# Altium project TAUV-Thruster_Board.PrjPcb
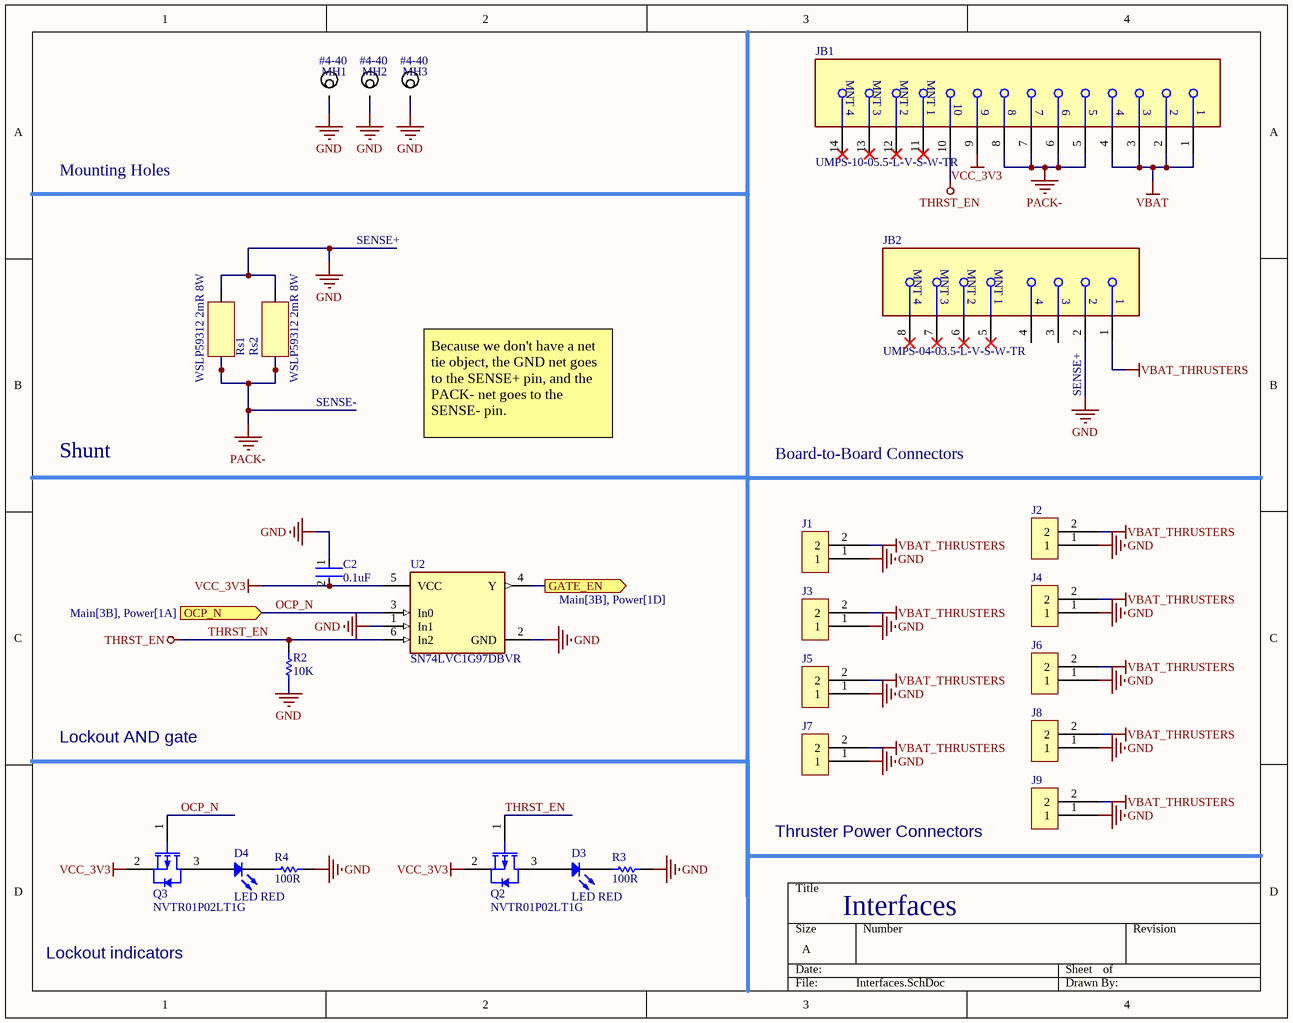
[diagram p0: Interfaces.SchDoc]
2 sheets, 41 parts. Net scope: flat (ports and power ports of the same name join across sheets).
Board file: TAUV-Thruster_Board.PcbDoc
Sheets:
  Interfaces.SchDoc
  Power.SchDoc

## Sheet Interfaces.SchDoc
size A; SheetNumber: 2; SheetTotal: 3

### Parts
C2  0.1uF  [FP-C0603C-CF-MFG]
D3  LED RED  [C0805]
D4  LED RED  [C0805]
J1  (no value)  [2-pin Megafit RA]
J2  (no value)  [2-pin Megafit RA]
J3  (no value)  [2-pin Megafit RA]
J4  (no value)  [2-pin Megafit RA]
J5  (no value)  [2-pin Megafit RA]
J6  (no value)  [2-pin Megafit RA]
J7  (no value)  [2-pin Megafit RA]
J8  (no value)  [2-pin Megafit RA]
J9  (no value)  [2-pin Megafit RA]
JB1  UMPS-10-05.5-L-V-S-W-TR  [FP-UMPS-10-05_5-L-V-S-W-T-MFG]
JB2  UMPS-04-03.5-L-V-S-W-TR  [FP-UMPS-04-03_5-L-V-S-W-T-MFG]
MH1  #4-40  [Mounting Hole #4-40]
MH2  #4-40  [Mounting Hole #4-40]
MH3  #4-40  [Mounting Hole #4-40]
Q2  NVTR01P02LT1G  [ONSC-SOT-23-3-318-08_V]
Q3  NVTR01P02LT1G  [ONSC-SOT-23-3-318-08_V]
R2  10K  [RESC0603(1608)_N]
R3  100R  [RESC1609X50X30NL10T20]
R4  100R  [RESC1609X50X30NL10T20]
Rs1  WSLP59312 2mR 8W  [WSLP59312L000FEA]
Rs2  WSLP59312 2mR 8W  [WSLP59312L000FEA]
U2  SN74LVC1G97DBVR  [FP-DBV0006A-MFG]

### Ports
GATE_EN (out, see Main[3B], Power[1D]), OCP_N (in, see Main[3B], Power[1A])

### Nets
GND: C2.1 J1.1 J2.1 J3.1 J4.1 J5.1 J6.1 J7.1 J8.1 J9.1 JB2.2 MH1.0 MH2.0 MH3.0 R2.2 R3.2 R4.2 Rs1.2 Rs2.2 U2.1(In1) U2.2(GND)
PACK-: JB1.5 JB1.6 JB1.7 JB1.8 Rs1.1 Rs2.1
THRST_EN: JB1.10 Q2.1(G) R2.1 U2.6(In2)
VBAT: JB1.1 JB1.2 JB1.3 JB1.4
VBAT_THRUSTERS: J1.2 J2.2 J3.2 J4.2 J5.2 J6.2 J7.2 J8.2 J9.2 JB2.1
VCC_3V3: C2.2 JB1.9 Q2.2(S) Q3.2(S) U2.5(VCC)
OCP_N: Q3.1(G) U2.3(In0) ; port OCP_N
NetD3_1: D3.1(K) R3.1
NetD3_2: D3.2(A) Q2.3(D)
NetD4_1: D4.1(K) R4.1
NetD4_2: D4.2(A) Q3.3(D)
NetRin1_2: U2.4(Y) ; port GATE_EN

Not connected (* = marked no-connect by the designer): JB1 11(MNT_1)* 12(MNT_2)* 13(MNT_3)* 14(MNT_4)*; JB2 3 4 5(MNT_1)* 6(MNT_2)* 7(MNT_3)* 8(MNT_4)*

### Notes on the sheet
- Mounting Holes
- SENSE+
- SENSE-
- Because we don't have a net tie object, the GND net goes to the SENSE+ pin, and the PACK- net goes to the SENSE- pin.
- (near JB2) SENSE+
- Shunt
- Board-to-Board Connectors
- Lockout AND gate
- Thruster Power Connectors
- Lockout indicators
- Interfaces

### Library data of the parts
C2 = CMP-1035-02580-3: CAP CER 0.1UF 10V X7R 0603; Manufacturer Part Number: C0603C104K8RACTU; Manufacturer: KEMET; Tolerance: 0.1; Value: 0.10 μF; Material: Ceramic; Temperature Coefficient: 30ppm/°C; Automotive Grade: Grade 1; Digikey Description: CAP CER 0.1UF 10V X7R 0603; Temperature Range High: +125°C; RoHS: TRUE; ComponentLink2URL: https://api.kemet.com/component-edge/download/datasheet/C0603C100J5GACAUTO.pdf; Lead Free: Yes; Device Class L2: Capacitors; Mouser Description: Multilayer Ceramic Capacitors MLCC - SMD/SMT 10volts 0.1uF X7R 10%; Temperature: -55°C to +125°C; Category: Cap; Height: 0.87mm; Voltage Rating: 10 V; Device Class L3: Ceramic Capacitors; ComponentLink2Description: Datasheet; Automotive: Yes; Octopart: https://octopart.com/c0603c104k8ractu-kemet-145075; Temperature Characteristic: X7R; Device Class L1: Passive Components; Temperature Range Low: -55°C; Package: C0603C-CF; Capacitance: 0.10 μF
D3 D4 = LED0: led / LTST-C171KRKT; Manufacturer: Lite-On Inc.; Lens Color: Colorless; Lens Transparency: Clear; Millicandela Rating: 54mcd; Lens Style/Size: Rectangle with Flat Top, 1.40mm x 1.25mm; Voltage - Forward (Vf) (Typ): 2V; Current - Test: 20mA; Viewing Angle: 130°; Wavelength - Dominant: 631nm; Wavelength - Peak: 639nm; Supplier 1: Digi-Key; Supplier Part Number 1: 160-1427-1-ND; Manufacturer Part Number: LTST-C171KRKT; RoHS: RoHS Compliant; Category: Optoelectronics; Stock 1: 260544; Pricing 1: 1=0.31, 10=0.225, 25=0.1656, 100=0.1183, 250=0.0804, 500=0.07096, 1000=0.05558 (USD); Packaging: Cut Tape (CT); Part Status: Active; Color: Red; Mounting Type: Surface Mount; Features: -; Package / Case: 0805 (2012 Metric); Size / Dimension: 2.00mm L x 1.25mm W; Height (Max): 0.80mm; ComponentLink1URL: http://optoelectronics.liteon.com/upload/download/DS22-2000-109/LTST-C171KRKT.pdf; ComponentLink1Description: http://optoelectronics.liteon.com/upload/download/DS22-2000-109/LTST-C171KRKT.pdf
J1-J9 = 2-pin megafit
JB1 = CMP-02770-000036-1: CONN MPOWER 2MM FMALE 10POS GOLD; System: Connector
JB2 = CMP-02770-000027-1: CONN MPOWER 2MM FMALE 4POS GOLD
MH1-MH3 = Mounting Hole #4-40, Loose Fit: Mounting Hole for ANSI #4-40 w/ Flat Washer, Loose Fit; Datasheet: http://blogs.mentor.com/tom-hausherr/blog/tag/pcb-mounting-holes/
Q2 Q3 = CMP-1058-00752-1: Power MOSFET, -20 V, -1.3 A, P-Channel, 3-Pin SOT-23, Pb-Free, Tape and Reel; Manufacturer: On Semiconductor; Ciss Typ (pF): 225; Configuration: Single; Coss Typ (pF): 130; PD Max (W): 0.4; ID Max (A): 1.3; Crss Typ (pF): 55; VGS Max (V): 12; V(BR)DSS Min (V): 20; VGS(th) Max (V): 1.25; Qrr Typ (nC): 8.5; Channel Polarity: P Channel; ComponentLink1URL: http://www.onsemi.com/; PackageReference: SOT-23-3-318-08; RoHS: Pb-Free; ComponentLink1Description: Manufacturer URL; PackageDescription: 3-Pin Small Outline Transistor, Body 2.92 x 1.3 mm, Pitch 0.95 mm; ComponentLink3Description: Package Specification; ComponentLink2Description: Datasheet; Package Type: SOT-23-3; ComponentLink2URL: http://www.onsemi.cn/pub_link/Collateral/NTR1P02LT1-D.PDF; Packing: Tape and Reel; Mounting Technology: Surface Mount; ComponentLink3URL: http://www.onsemi.cn/pub_link/Collateral/318-08.PDF; PartNumber: NVTR01P02LT1G; PackageVersion: Rev. AP, 11/2009; DatasheetVersion: Rev. 13
R2 = CMP-1012-00098-1: 10K 0.1W 5% 0603 (1608 Metric)  SMD; Case-EIA: 0603; Value: 10000.00 Ohm; Case-Metric: 1608; Technology: SMT; Tolerance: 5 %; Power: 0.1 W
R3 R4 = CMP-1012-00050-2: 100R 0.1W 5%; Part Number: CRCW0603100RJNTA; Manufacturer: Vishay Dale
Rs1 Rs2 = WSLP59312L000FEA
U2 = CMP-0859-00234-4: IC CONFIG MULT-FUNC GATE SOT23-6; Manufacturer: Texas Instruments; Logic Function Desc: Dual; Min Supply Voltage: 1.65V; Number Of Inputs: 3; Nominal Supply Current: 10uA; Max Supply Voltage: 5.5V; Number Of Circuits: 1; Propagation Delay: 6.1ns; Standoff Height: 0mm; Max Junction Temp: +150°C; Category: IC; Device Class L3: Logic Gates; ComponentLink2Description: Datasheet; Ipc Land Pattern Name: SOT95P280X145-6; RoHS: TRUE; Temperature Range High: +125°C; Octopart: https://octopart.com/sn74lvc1g97dbvr-texas+instruments-464842; Package: DBV0006A; Device Class L2: Logic ICs; Temperature Range Low: -40°C; Ambient Temperature Range High: +125°C; Height: 1.45mm; Automotive: No; Lead Free: Yes; Mouser Description: Logic Gates Cnfgrble Mult Function Gate; Temperature: -40°C to +125°C; Number Of Outputs: 1; Digikey Description: IC CONFIG MULT-FUNC GATE SOT23-6; Manufacturer Part Number: SN74LVC1G97DBVR; Device Class L1: Integrated Circuits (ICs); Ambient Temperature Range Low: -40°C; ComponentLink2URL: http://www.ti.com/lit/ds/symlink/sn74lvc1g97.pdf

## Sheet Power.SchDoc
size A; SheetNumber: 3; SheetTotal: 3
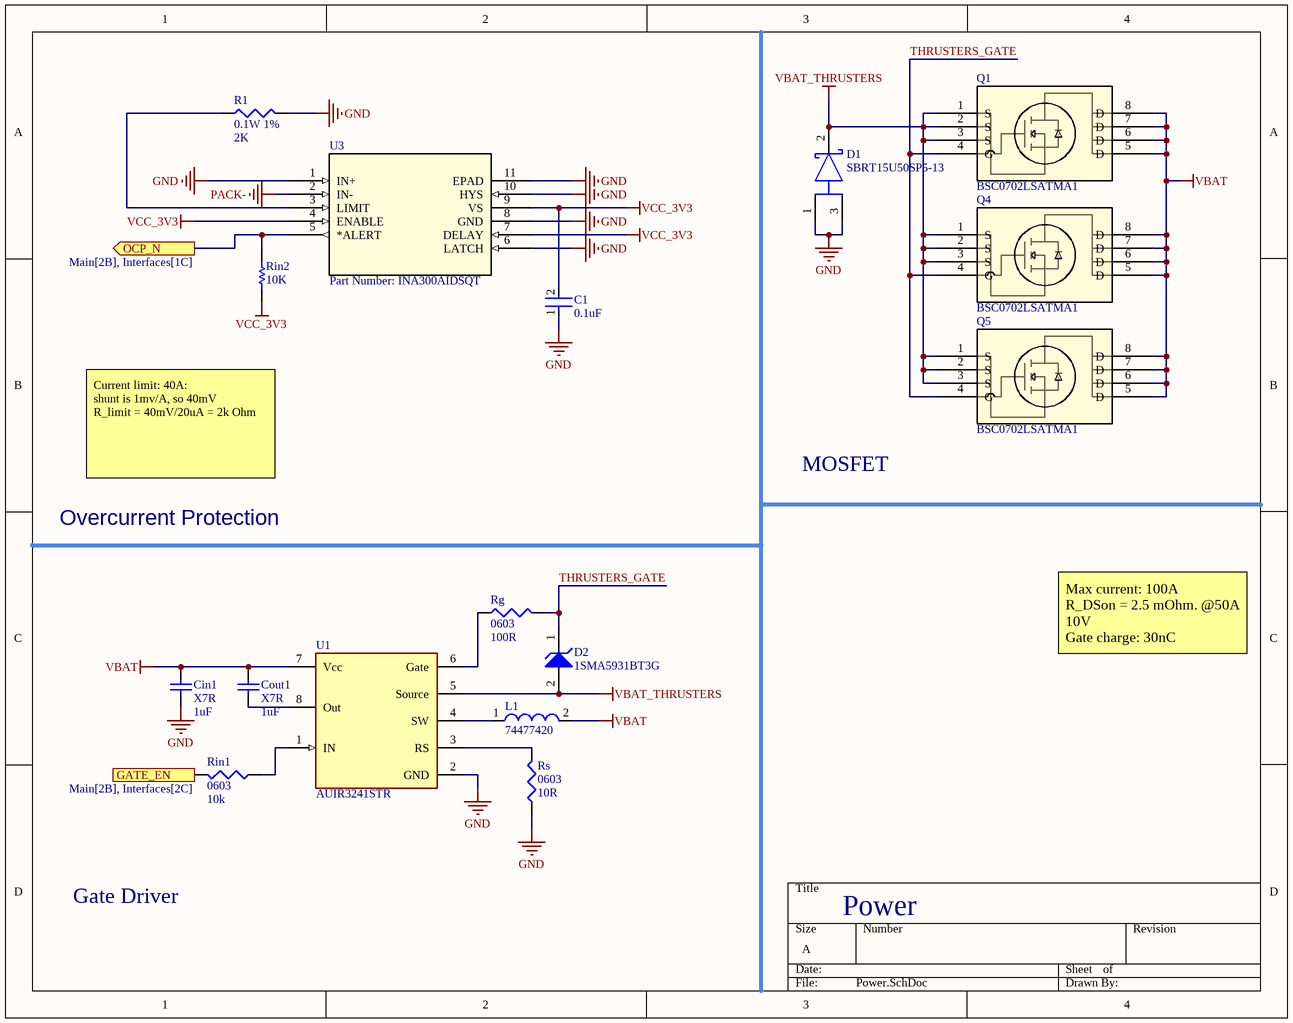
[diagram p1: Power.SchDoc]

### Parts
C1  0.1uF  [FP-C0603C-CF-MFG]
Cin1  X7R  value 1uF  [C0805]
Cout1  X7R  value 1uF  [C0805]
D1  SBRT15U50SP5-13  [FP-PowerDI5-MFG]
D2  1SMA5931BT3G  [ONSC-SMA-2-403D-02_F_V]
L1  74477420  [WE-PD2-M]
Q1  BSC0702LSATMA1  [PG-TDSON-8-7]
Q4  BSC0702LSATMA1  [PG-TDSON-8-7]
Q5  BSC0702LSATMA1  [PG-TDSON-8-7]
R1  0.1W 1%  value 2K  [J1-0603]
Rg  0603  value 100R  [J1-0603]
Rin1  0603  value 10k  [J1-0603]
Rin2  10K  [RESC0603(1608)_N]
Rs  0603  value 10R  [J1-0603]
U1  AUIR3241STR  [FP-PG-DSO-8-MFG]
U3  Part Number: INA300AIDSQT  [DSQ10_P9X1P5]

### Ports
GATE_EN (in, see Main[2B], Interfaces[2C]), OCP_N (out, see Main[2B], Interfaces[1C])

### Nets
GND: C1.1 Cin1.1 D1.1(A) D1.3(A) R1.2 Rs.1 U1.2(GND) U3.1(IN+) U3.6(LATCH) U3.8(GND) U3.10(HYS) U3.11(EPAD)
PACK-: U3.2(IN-)
VBAT: Cin1.2 Cout1.2 L1.2 Q1.5(D) Q1.6(D) Q1.7(D) Q1.8(D) Q4.5(D) Q4.6(D) Q4.7(D) Q4.8(D) Q5.5(D) Q5.6(D) Q5.7(D) Q5.8(D) U1.7(Vcc)
VBAT_THRUSTERS: D1.2(C) D2.2(A) Q1.1(S) Q1.2(S) Q1.3(S) Q4.1(S) Q4.2(S) Q4.3(S) Q5.1(S) Q5.2(S) Q5.3(S) U1.5(Source)
VCC_3V3: C1.2 Rin2.2 U3.4(ENABLE) U3.7(DELAY) U3.9(VS)
OCP_N: Rin2.1 U3.5(*ALERT) ; port OCP_N
THRUSTERS_GATE: D2.1(K) Q1.4(G) Q4.4(G) Q5.4(G) Rg.2
NetCout1_1: Cout1.1 U1.8(Out)
NetL1_1: L1.1 U1.4(SW)
NetR1_1: R1.1 U3.3(LIMIT)
NetRg_1: Rg.1 U1.6(Gate)
NetRin1_1: Rin1.1 U1.1(IN)
NetRin1_2: Rin1.2 ; port GATE_EN
NetRs_2: Rs.2 U1.3(RS)

### Notes on the sheet
- Current limit: 40A:
  shunt is 1mv/A, so 40mV
  R_limit = 40mV/20uA = 2k Ohm
- MOSFET
- Overcurrent Protection
- Max current: 100A
  R_DSon = 2.5 mOhm. @50A 10V
  Gate charge: 30nC
- Gate Driver
- Power

### Library data of the parts
C1 = CMP-1035-02580-3: as C2 on sheet Interfaces; Digikey Description: CAP CER 0.1UF 10V X7R 0603; Temperature Range High: +125°C; RoHS: TRUE; ComponentLink2URL: https://api.kemet.com/component-edge/download/datasheet/C0603C100J5GACAUTO.pdf; Lead Free: Yes; Device Class L2: Capacitors; Mouser Description: Multilayer Ceramic Capacitors MLCC - SMD/SMT 10volts 0.1uF X7R 10%; Temperature: -55°C to +125°C; Category: Cap; Height: 0.87mm; Voltage Rating: 10 V; Device Class L3: Ceramic Capacitors; ComponentLink2Description: Datasheet; Automotive: Yes; Octopart: https://octopart.com/c0603c104k8ractu-kemet-145075; Temperature Characteristic: X7R; Device Class L1: Passive Components; Temperature Range Low: -55°C; Package: C0603C-CF; Capacitance: 0.10 μF
Cin1 Cout1 = Cap: Capacitor; Published: 8-Jun-2000; LatestRevisionDate: 17-Jul-2002; LatestRevisionNote: Re-released for DXP Platform.; PackageReference: RAD-0.3; Publisher: Altium Limited; PackageDescription: Radial Cap, Thru-Hole; 2 Leads; 0.3 in Pin Spacing
D1 = CMP-12791-000016-1: 50V 15A Rectifier Schottky Diode; Manufacturer: Diodes Inc.; Manufacturer Part Number: PDS3200-13; Standoff Height: 0mm; Forward Current: 3A; Reverse Voltage: 200V; Max Junction Temp: +150°C; Peak Reverse Current: 1uA; Max Surge Forward Current: 180A; RoHS: TRUE; ComponentLink2Description: Datasheet; Temperature: -65°C to +150°C; Category: Diode; Digikey Description: DIODE SCHOTTKY 200V 3A POWERDI5; Height: 1.15mm; Octopart: https://octopart.com/pds3200-13-diodes+inc.-332544; Device Class L1: Discrete Semiconductors; Mouser Description: PDS3200 Series 200 V 3 A High Voltage Schottky Barrier Rectifier - PowerDI-5; ComponentLink2URL: https://www.diodes.com/assets/Datasheets/ds30470.pdf; Temperature Range Low: -65°C; Lead Free: Yes; Max Repetitive Reverse Voltage: 200V; Device Class L2: Diodes; Footprint Url: https://www.diodes.com/assets/Package-Files/PowerDI5.pdf; Package: PowerDI5; Temperature Range High: +150°C; Automotive: No; Device Class L3: Rectifier Diodes
D2 = CMP-1060-00118-1: 1.5 W Zener Voltage Regulator, 2-Pin SMA, Pb-Free, Tape and Reel; Manufacturer: On Semiconductor; VZ Typ (V): 18; Mounting Technology: Surface Mount; RoHS: Pb-Free; PackageDescription: 2-Pin Small Molded Package, J-Bend Lead, Body 2.605 x 4.315 mm; ComponentLink2Description: Datasheet; DatasheetVersion: Rev. 8; ComponentLink2URL: http://www.onsemi.com/pub_link/Collateral/1SMA5913BT3-D.PDF; ComponentLink3URL: http://www.onsemi.com/pub_link/Collateral/1SMA5913BT3-D.PDF; ComponentLink1URL: http://www.onsemi.com/; ComponentLink1Description: Manufacturer URL; Packing: Tape and Reel; ComponentLink3Description: Package Specification; PackageVersion: Rev. F, 11/2008; PartNumber: 1SMA5931BT3G; PackageReference: SMA-2-403D-02_F
L1 = CMP-0227-00441-1: SMD Power Inductor WE-PD2, L = 100 µH; Inductance: 100 ÂµH; ComponentLink2Description: Datasheet; ComponentLink1URL: http://www.we-online.com; DatasheetVersion: ver 2, Jun-2005; ComponentLink2URL: http://www.we-online.de/katalog/media/pdf/74477420.pdf; PackageDescription: SMD Inductor, 2-Leads, Body 5.8 x 5.2 mm; PackageVersion: 2005; ComponentLink1Description: Manufacturer Link; PackageReference: WE-PD2-M
Q1 Q4 Q5 = BSC0702LSATMA1: No Description Available; Mfr_Name: Infineon; RefDes: RefDes; Type: Type
R1 = Res3: 2k 0.1W 1%; Published: 8-Jun-2000; LatestRevisionDate: 29-May-2009; LatestRevisionNote: IPC-7351 Footprint Added.; PackageReference: J1-0603; Publisher: Altium Limited; PackageDescription: Chip Resistor
Rg Rin1 Rs = Res3: Resistor; Published: 8-Jun-2000; LatestRevisionDate: 29-May-2009; LatestRevisionNote: IPC-7351 Footprint Added.; PackageReference: J1-0603; Publisher: Altium Limited; PackageDescription: Chip Resistor
Rin2 = CMP-1012-00098-1: as R2 on sheet Interfaces; Technology: SMT; Tolerance: 5 %; Power: 0.1 W
U1 = CMP-32851-000034-1: IC GATE DRVR HIGH-SIDE 8SO; Output Current: 300mA; Number of Drivers: 1; Mount: Surface Mount; Packaging: Cut Tape; RoHS Compliant: Yes; Lead Free: Lead Free; Max Operating Temperature: 150°C; Min Operating Temperature: -40°C; Halogen Free: Halogen Free; Number of Pins: 8; Case/Package: SOIC
U3 = INA300AIDSQT: No Description Available; Vendor: Texas Instruments; Built_By: EMA_UL_Team; Manufacturer_Part_Number: INA300AIDSQT; Copyright: Copyright (C) 2018 Accelerated Designs. All rights reserved; RefDes: RefDes; Type: DEV; Value: Value

## Nets that join several sheets
GND: Interfaces (21 pins), Power (12 pins)
PACK-: Interfaces (6 pins), Power (U3.2)
VBAT: Interfaces (JB1.1 JB1.2 JB1.3 JB1.4), Power (16 pins)
VBAT_THRUSTERS: Interfaces (10 pins), Power (12 pins)
VCC_3V3: Interfaces (5 pins), Power (5 pins)
NetRin1_2: Interfaces (U2.4), Power (Rin1.2)
OCP_N: Interfaces (Q3.1 U2.3), Power (Rin2.1 U3.5)